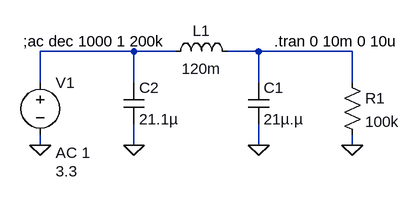
[diagram p0: schematic Powerfilter.asc]
Powerfilter.asc, the LTspice schematic file:
Version 4
SHEET 1 880 680
WIRE 176 144 32 144
WIRE 240 144 176 144
WIRE 368 144 320 144
WIRE 512 144 368 144
WIRE 32 192 32 144
WIRE 176 192 176 144
WIRE 368 192 368 144
WIRE 512 192 512 144
WIRE 32 288 32 272
WIRE 176 288 176 256
WIRE 368 288 368 256
WIRE 512 288 512 272
FLAG 368 288 0
FLAG 176 288 0
FLAG 32 288 0
FLAG 512 288 0
SYMBOL ind 224 160 R270
WINDOW 0 32 56 VTop 2
WINDOW 3 5 56 VBottom 2
SYMATTR InstName L1
SYMATTR Value 120m
SYMATTR SpiceLine Ipk=0.069 Rser=150
SYMBOL cap 352 192 R0
SYMATTR InstName C1
SYMATTR Value 21µ.µ
SYMBOL cap 160 192 R0
SYMATTR InstName C2
SYMATTR Value 21.1µ
SYMBOL voltage 32 176 R0
WINDOW 3 24 152 Left 2
WINDOW 123 24 124 Left 2
WINDOW 39 0 0 Left 0
SYMATTR InstName V1
SYMATTR Value 3.3
SYMATTR Value2 AC 1
SYMBOL res 496 176 R0
SYMATTR InstName R1
SYMATTR Value 100k
TEXT 6 128 Left 2 !;ac dec 1000 1 200k
TEXT 392 128 Left 2 !.tran 0 10m 0 10u

The netlist it stands for:
* Powerfilter.asc
L1 N001 N002 120m Ipk=0.069 Rser=150
C1 N002 0 21µ.µ
C2 N001 0 21.1µ
V1 N001 0 3.3 AC 1
R1 N002 0 100k
;ac dec 1000 1 200k
.tran 0 10m 0 10u
.backanno
.end